# Altium schematic sheet PWR_MGMT.SchDoc
size B; SheetNumber: 4; SheetTotal: 5
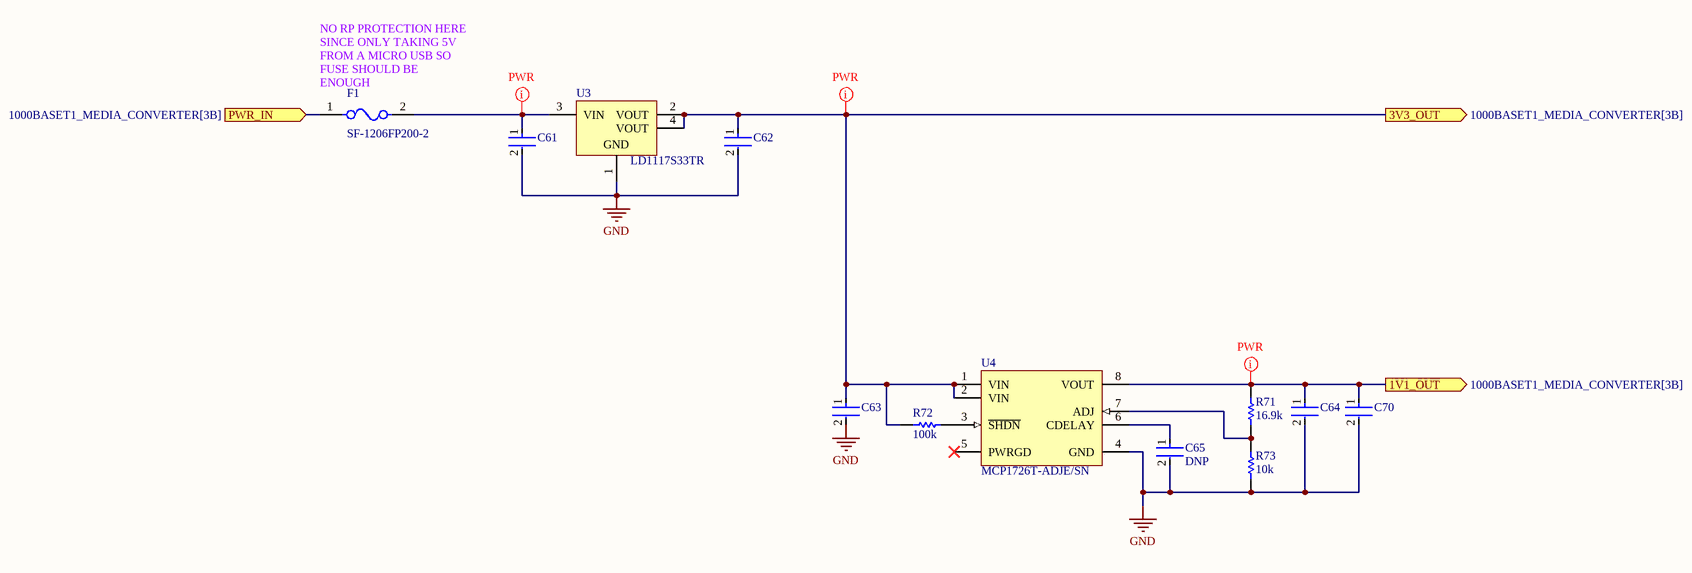
[diagram p0: PWR_MGMT.SchDoc]

## Parts
C61  C0805C475J4RACAUTO  [FP-C0805C475J4RACAUTO-MFG]  (value not drawn)
C62  GRM21BR61E226ME44L  [FP-GRM21B-0_2-e0_2_0_7-IPC_B]  (value not drawn)
C63  C0805C475J4RACAUTO  [FP-C0805C475J4RACAUTO-MFG]  (value not drawn)
C64  GRM21BR61E226ME44L  [FP-GRM21B-0_2-e0_2_0_7-IPC_B]  (value not drawn)
C65  DNP  [FP-0402-L_1_0_0_05-W_0_5-IPC_A]
C70  C0805C475J4RACAUTO  [FP-C0805C475J4RACAUTO-MFG]  (value not drawn)
F1  SF-1206FP200-2  [FP-SF-1206FP-MFG]
R71  16.9k  [R0603B]
R72  100k  [R0603B]
R73  10k  [R0603B]
U3  LD1117S33TR  [SOT-223_L]
U4  MCP1726T-ADJE/SN  [SOIC-SN8_L]

## Ports
1V1_OUT (out, see 1000BASET1_MEDIA_CONVERTER[3B]), 3V3_OUT (out, see 1000BASET1_MEDIA_CONVERTER[3B]), PWR_IN (in, see 1000BASET1_MEDIA_CONVERTER[3B])

## Nets
GND: C61.2 C62.2 C63.2 C64.2 C65.2 C70.2 R73.1 U3.1(GND) U4.4(GND)
1V1_OUT: C64.1 C70.1 R71.2 U4.8(VOUT) ; port 1V1_OUT
3V3_OUT: C62.1 C63.1 R72.1 U3.2(VOUT) U3.4(VOUT) U4.1(VIN) U4.2(VIN) ; port 3V3_OUT
PWR_IN: F1.1 ; port PWR_IN
NetC61_1: C61.1 F1.2 U3.3(VIN)
NetC65_1: C65.1 U4.6(CDELAY)
NetR71_1: R71.1 R73.2 U4.7(ADJ)
NetR72_2: R72.2 U4.3(~{SHDN})

Not connected (* = marked no-connect by the designer): U4 5(PWRGD)*

## Layout directives
net class PWR: 1V1_OUT, 3V3_OUT, NetC61_1

## Notes on the sheet
- (near F1) NO RP PROTECTION HERE SINCE ONLY TAKING 5V FROM A MICRO USB SO FUSE SHOULD BE ENOUGH

## Library data of the parts
C61 C63 C70 = CMP-00212-84766729-1: C0805C475J4RACAUTO Cap Ceramic 4.7uF 16V X7R 5% Pad SMD 0805 125C Automotive T/R; Capacitance: 4.7µF; Max Operating Temperature: 125°C; Dielectric Material: Ceramic; Voltage Rating (DC): 16V; Dielectric: X7R; Height: 1.4mm; Case/Package: 0805; NexarPartId: 84766729; Voltage Rating: 16V; RoHS: Compliant; Material: Ceramic; Packaging: Cut Tape; Tolerance: 5%; Min Operating Temperature: -55°C
C62 C64 = CMP-2007-03222-3: Chip Multilayer Ceramic Capacitors for General Purpose, 0805, 22uF, X5R, 15%, 20%, 25V; Case/Package: 0805; Depth: 1.25mm; Resistor Type: Ceramic; Voltage Rating: 25V; Lead Free: Lead Free; Voltage Rating (DC): 25V; Case Code (Metric): 2012; Thickness: 0.057inch; REACH SVHC: No SVHC; Material: Ceramic; Tolerance: 20%; Length: 2mm; Capacitance: 22uF; Case Code (Imperial): 0805; Max Operating Temperature: 85°C; Termination: SMD/SMT; Weight: 0.000335oz; Dielectric: X5R; Packaging: Tape and Reel; Voltage: 25V; Package Quantity: 3000; Height: 1.25mm; Mount: Surface Mount; Width: 1.25mm; Min Operating Temperature: -55°C
C65 = CMP-001-00058-1: LARGE PADS, 0402 CAP, CHANGE COMMENT TO MATCH REAL P/N; Capacitor Type: Ceramic; Min Operating Temperature: -55°C; Mounting Technology: Surface Mount; Pins: 2; Case/Package: 0402; RoHS Compliant: Yes; Max Operating Temperature: 85°C
F1 = CMP-07399-000013-1: FUSE BOARD MOUNT 2A 63VDC 1206; Voltage Rating (DC): 63V; Fuse Type: Board Mount (Cartridge Style Excluded); Approvals: UL; Mount: Surface Mount; Min Operating Temperature: -20°C; Max Operating Temperature: 105°C; Case Code (Imperial): 1206; Packaging: Cut Tape; Current Rating: 2A; RoHS Compliant: Yes; Series: SinglFuse™ SF-1206FP; Case Code (Metric): 3216; Case/Package: 1206
R71-R73 = CMP-009-00002-14: Resistor
  R71: Value: 16.9k
  R72: Value: 100k
  R73: Value: 10k
U3 = CMP-0244-00310-1: Fixed Low Drop Positive Voltage Regulator, 3.3V, 4-Pin SOT-223, Tape and Reel; ComponentLink2Description: Datasheet; PackageDescription: 4-Pin SOT-223 Package, 6.5 x 3.5 mm Body, 2.3 mm Pitch, 7 mm Lead Span; PackageVersion: 2010; ComponentLink2URL: http://www.st.com/internet/com/TECHNICAL_RESOURCES/TECHNICAL_LITERATURE/DATASHEET/CD00000544.pdf; PackageReference: SOT-223; DatasheetVersion: 1/11/2011; ComponentLink1Description: Manufacturer URL; ComponentLink1URL: http://www.st.com
U4 = CMP-0136-00217-1: 1A, Low Voltage, Low Quiescent Current LDO Regulator, 8-Pin SOIC 150mil, Extended Temperature, Tape and Reel; DatasheetVersion: revC, Aug-2007; PackageReference: SOIC-SN8; Code_IPC: SOIC127P600-8; PackageVersion: revBB, Aug-2009; PackageDescription: 8-Lead Plastic Small Outline (SN) - Narrow, 3.90mm Body [SOIC]; Code_JEDEC: MS-012